# Altium schematic sheet Sheet MP.SchDoc
size A; SheetNumber: 1; SheetTotal: 1
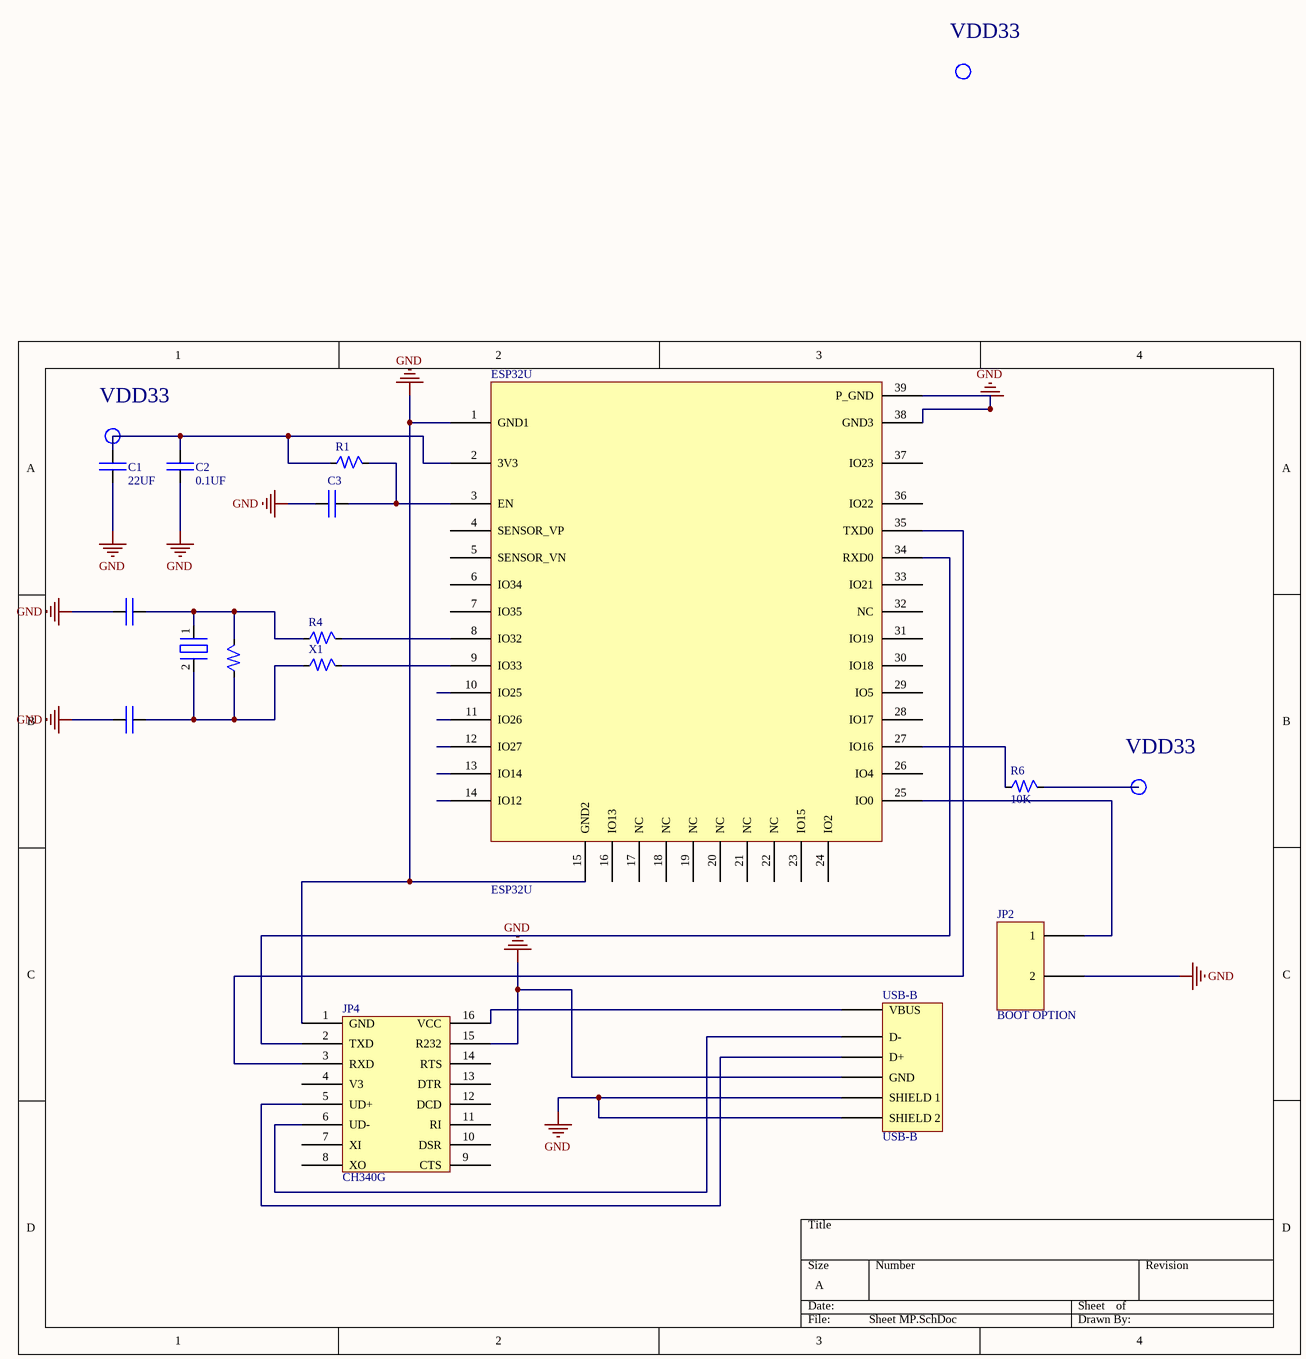
[diagram p0: Sheet MP.SchDoc]

## Parts
C1  22UF  [Capacitor]
C2  0.1UF  [Capacitor]
C3  CAP  [Capacitor]  (value not drawn)
C4  CAP  [Capacitor]  (value not drawn)
C5  CAP  [Capacitor]  (value not drawn)
ESP32U  ESP32U  [ESP32U]
JP2  BOOT OPTION  [HEADER 2 PINS - duplicate]
JP4  CH340G  [CH340G - duplicate1]
R1  0805  [Resistor]  (value not drawn)
R4  0805  [Resistor]  (value not drawn)
R5  0805  [Resistor]  (value not drawn)
R6  10K  [Resistor]
T1  CRYSTAL  [CRYSTAL]  (value not drawn)
USB-B  USB-B  [USB-B - duplicate1]
X1  0805  [Resistor]  (value not drawn)

## Nets
GND: C1.1 C2.1 C3.2 C4.2 C5.2 ESP32U.1(GND1) ESP32U.15(GND2) ESP32U.38(GND3) ESP32U.39(P_GND) JP2.2 JP4.1(GND) JP4.15(R232) USB-B.4(GND) USB-B.5(SHIELD_1) USB-B.6(SHIELD_2)
NetC1_2: C1.2 C2.2 ESP32U.2(3V3) R1.1
NetC3_1: C3.1 ESP32U.3(EN) R1.2
NetC4_1: C4.1 R5.1 T1.2 X1.1
NetC5_1: C5.1 R4.1 R5.2 T1.1
NetESP32U_8: ESP32U.8(IO32) R4.2
NetESP32U_9: ESP32U.9(IO33) X1.2
NetESP32U_25: ESP32U.25(IO0) JP2.1
NetESP32U_27: ESP32U.27(IO16) R6.1
NetESP32U_34: ESP32U.34(RXD0) JP4.2(TXD)
NetESP32U_35: ESP32U.35(TXD0) JP4.3(RXD)
NetJP4_5: JP4.5(UD+) USB-B.3(D+)
NetJP4_6: JP4.6(UD-) USB-B.2(D-)
NetJP4_16: JP4.16(VCC) USB-B.1(VBUS)

Not connected (* = marked no-connect by the designer): ESP32U 4(SENSOR_VP) 5(SENSOR_VN) 6(IO34) 7(IO35) 10(IO25) 11(IO26) 12(IO27) 13(IO14) 14(IO12) 16(IO13) 17(NC) 18(NC) 19(NC) 20(NC) 21(NC) 22(NC) 23(IO15) 24(IO2) 26(IO4) 28(IO17) 29(IO5) 30(IO18) 31(IO19) 32(NC) 33(IO21) 36(IO22) 37(IO23); JP4 4(V3) 7(XI) 8(XO) 9(CTS) 10(DSR) 11(RI) 12(DCD) 13(DTR) 14(RTS); R6 2

## Notes on the sheet
- VDD33

## Library data of the parts
C1-C5 = CAP: MANUFACTURER: PANASONIC; MANUFACTURER PART: EEHZA1V470P; SUPPLIER PART NUMBER: C178639; SUPPLIER: LCSC
ESP32U = ESP32U: MANUFACTURER: Ai-Thinker; MANUFACTURER PART: ESP32-S; SUPPLIER PART NUMBER: C277944; SUPPLIER: LCSC
JP2 = HEADER 2 PINS: MANUFACTURER: JST Sales America Inc.; MANUFACTURER PART: B2B-XH-A; SUPPLIER PART NUMBER: 455-B2B-XH-A-ND; SUPPLIER: DIGIKEY
JP4 = CH340G: MANUFACTURER: WCH; MANUFACTURER PART: CH340G; SUPPLIER PART NUMBER: C14267; SUPPLIER: LCSC
R1 R4-R6 X1 = 0805: MANUFACTURER: YAGEO; MANUFACTURER PART: RC0805FR-0710KL; SUPPLIER PART NUMBER: C84376; SUPPLIER: LCSC
T1 = CRYSTAL: MANUFACTURER: EPSON; MANUFACTURER PART: Q13FC13500004; SUPPLIER PART NUMBER: C32346; SUPPLIER: LCSC
USB-B = USB-B: MANUFACTURER: Switchcraft Inc.; MANUFACTURER PART: RAHUB20; SUPPLIER PART NUMBER: 137-RAHUB20-ND; SUPPLIER: DIGIKEY